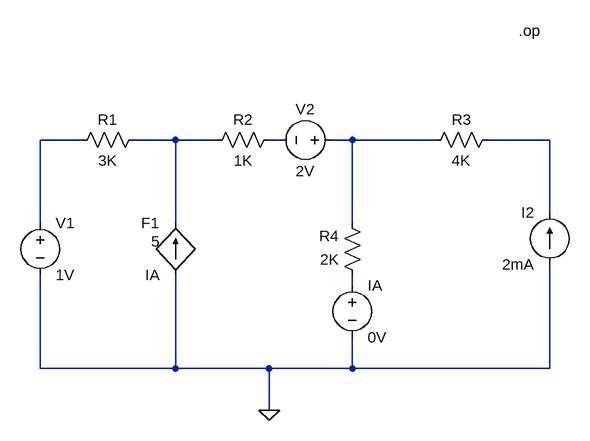
[diagram p0: schematic Draft1.asc]
Draft1.asc, the LTspice schematic file:
Version 4.1
SHEET 1 880 680
WIRE 64 -272 0 -272
WIRE 208 -272 144 -272
WIRE 272 -272 208 -272
WIRE 368 -272 352 -272
WIRE 480 -272 448 -272
WIRE 608 -272 480 -272
WIRE 784 -272 688 -272
WIRE 784 -160 784 -272
WIRE 0 -144 0 -272
WIRE 208 -144 208 -272
WIRE 480 -144 480 -272
WIRE 480 -48 480 -64
WIRE 0 80 0 -64
WIRE 208 80 208 -64
WIRE 208 80 0 80
WIRE 352 80 208 80
WIRE 480 80 480 32
WIRE 480 80 352 80
WIRE 784 80 784 -80
WIRE 784 80 480 80
WIRE 352 144 352 80
FLAG 352 144 0
SYMBOL res 160 -288 R90
WINDOW 0 0 56 VBottom 2
WINDOW 3 32 56 VTop 2
SYMATTR InstName R1
SYMATTR Value 3K
SYMBOL res 368 -288 R90
WINDOW 0 0 56 VBottom 2
WINDOW 3 32 56 VTop 2
SYMATTR InstName R2
SYMATTR Value 1K
SYMBOL res 704 -288 R90
WINDOW 0 0 56 VBottom 2
WINDOW 3 32 56 VTop 2
SYMATTR InstName R3
SYMATTR Value 4K
SYMBOL res 496 -48 R180
WINDOW 0 36 76 Left 2
WINDOW 3 36 40 Left 2
SYMATTR InstName R4
SYMATTR Value 2K
SYMBOL current 784 -80 R180
WINDOW 0 24 80 Left 2
WINDOW 3 24 0 Left 2
SYMATTR InstName I2
SYMATTR Value 2mA
SYMBOL f 208 -64 R180
WINDOW 0 24 80 Left 2
WINDOW 3 24 0 Left 2
WINDOW 123 24 52 Left 2
SYMATTR InstName F1
SYMATTR Value IA
SYMATTR Value2 5
SYMBOL voltage 0 -160 R0
SYMATTR InstName V1
SYMATTR Value 1V
SYMBOL voltage 464 -272 R90
WINDOW 0 -32 56 VBottom 2
WINDOW 3 32 56 VTop 2
SYMATTR InstName V2
SYMATTR Value 2V
SYMBOL voltage 480 -64 R0
SYMATTR InstName IA
SYMATTR Value 0V
TEXT 736 -440 Left 2 !.op

The netlist it stands for:
* Draft1.asc
R1 N002 N001 3K
R2 N003 N002 1K
R3 N005 N004 4K
R4 N006 N004 2K
I2 0 N005 2mA
F1 0 N002 IA 5
V1 N001 0 1V
V2 N004 N003 2V
V§IA N006 0 0V
.op
.backanno
.end